# EAGLE schematic 1.5KbeaconDetectorV2.0 (EAGLE 9.6.2)
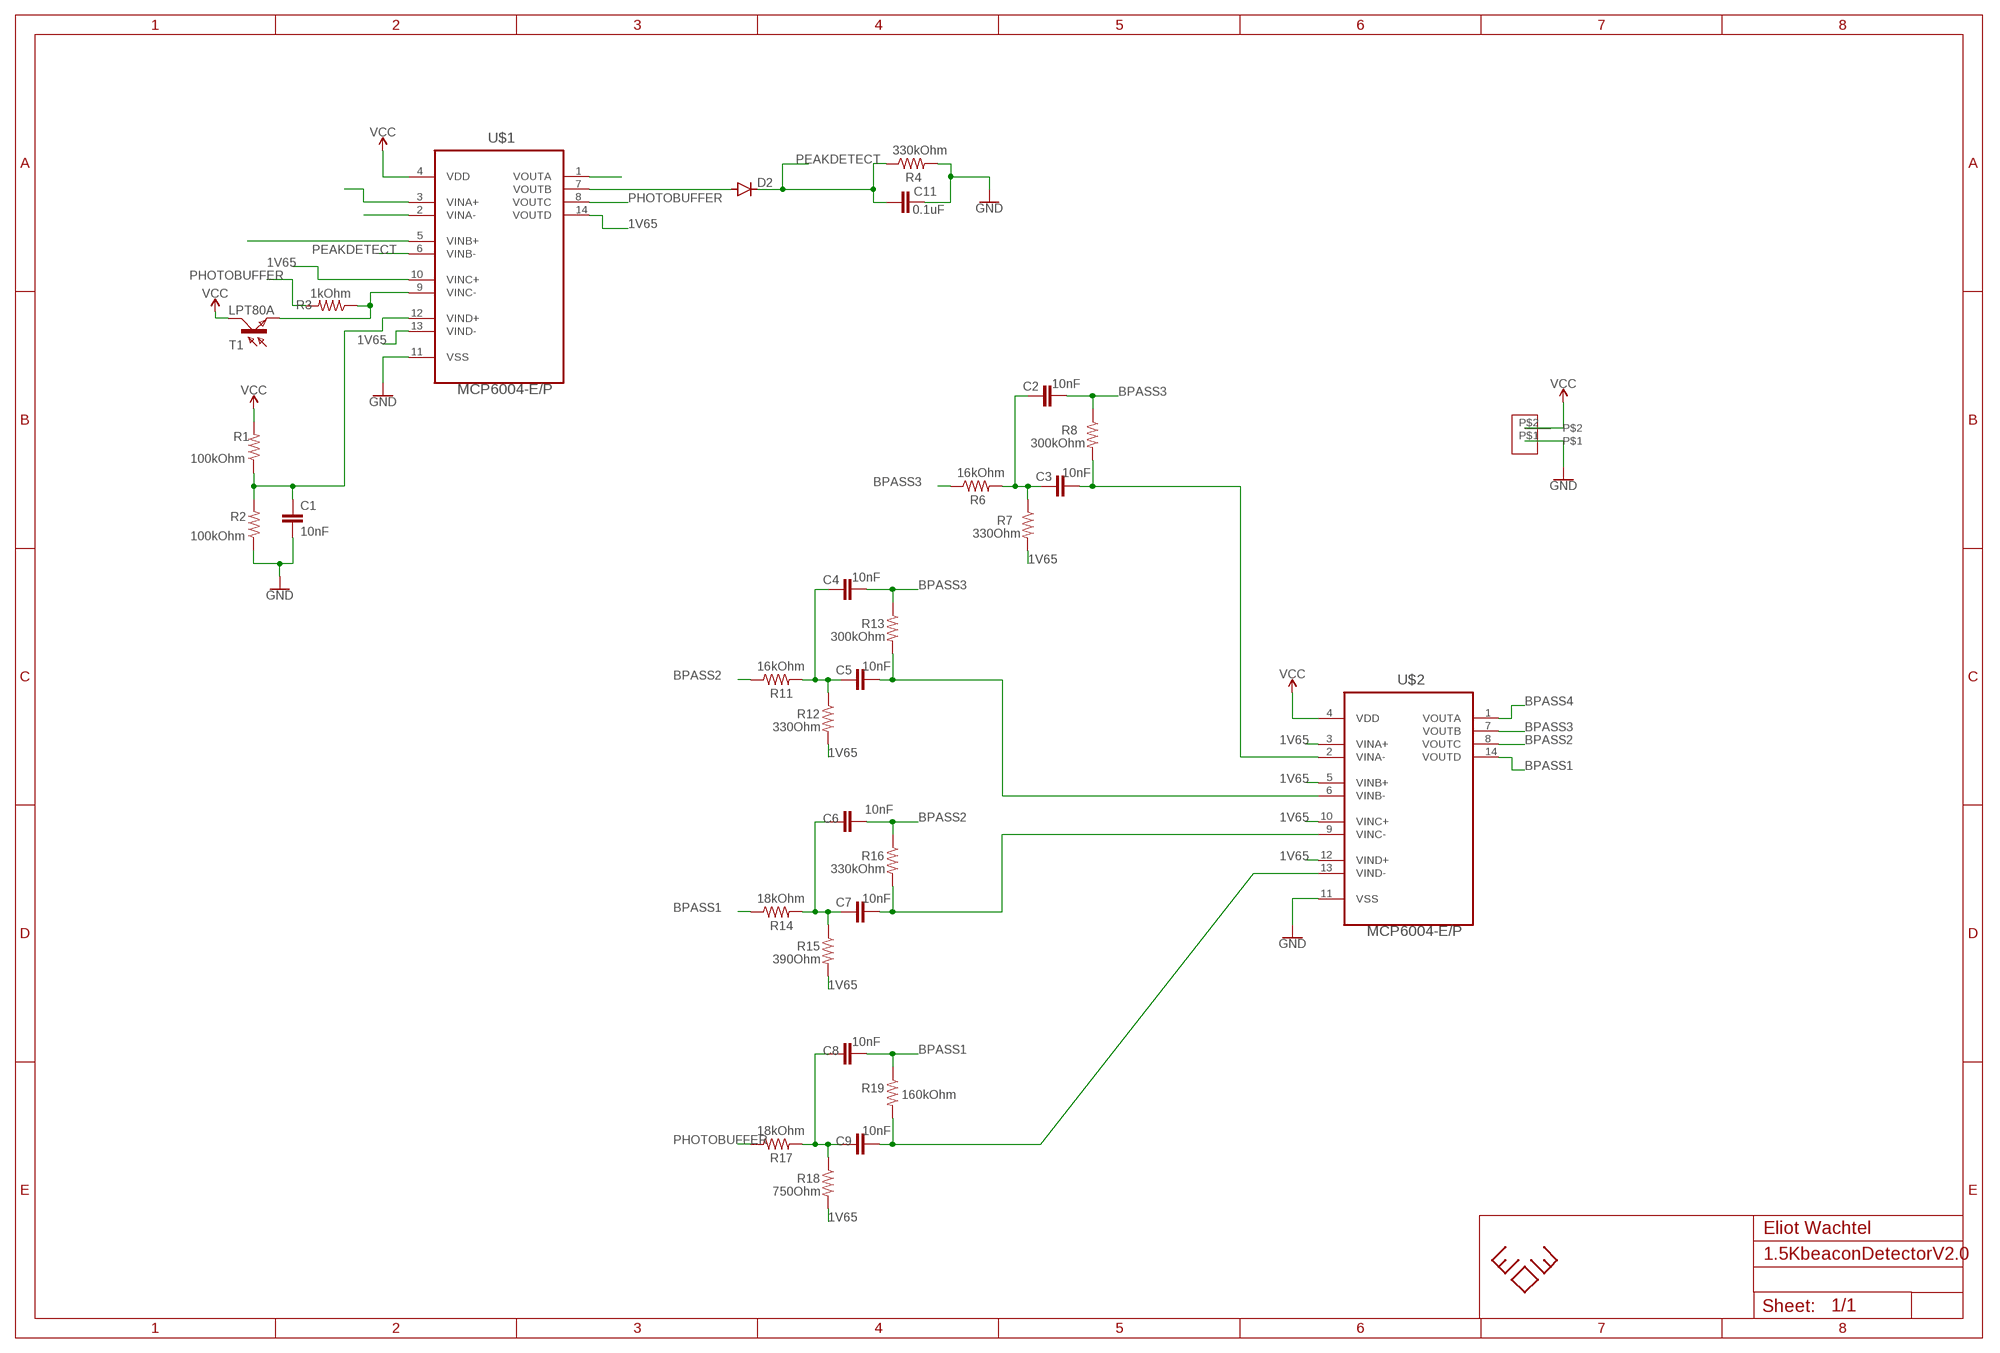
[diagram p0: schematic, sheet 1]

## Parts
C1  10nF  C5/2.5  [C5B2.5]
C2  10nF  C5/2.5  [C5B2.5]
C3  10nF  C5/2.5  [C5B2.5]
C4  10nF  C5/2.5  [C5B2.5]
C5  10nF  C5/2.5  [C5B2.5]
C6  10nF  C5/2.5  [C5B2.5]
C7  10nF  C5/2.5  [C5B2.5]
C8  10nF  C5/2.5  [C5B2.5]
C9  10nF  C5/2.5  [C5B2.5]
C11  0.1uF  C5/2.5  [C5B2.5]
D2  DIODE-D-7.5  [D-7.5]
R1  100kOhm  R-US_0204/7  [0204/7]
R2  100kOhm  R-US_0204/7  [0204/7]
R3  1kOhm  R-US_0204/2V  [0204V]
R4  330kOhm  R-US_0204/5  [0204/5]
R6  16kOhm  R-US_0204/2V  [0204V]
R7  330Ohm  R-US_0204/7  [0204/7]
R8  300kOhm  R-US_0204/5  [0204/5]
R11  16kOhm  R-US_0204/2V  [0204V]
R12  330Ohm  R-US_0204/7  [0204/7]
R13  300kOhm  R-US_0204/5  [0204/5]
R14  18kOhm  R-US_0204/5  [0204/5]
R15  390Ohm  R-US_0204/7  [0204/7]
R16  330kOhm  R-US_0204/5  [0204/5]
R17  18kOhm  R-US_0204/5  [0204/5]
R18  750Ohm  R-US_0204/7  [0204/7]
R19  160kOhm  R-US_0204/2V  [0204V]
T1  LPT80A  [LPT80A]
U$1  MCP6004-E/P  [DIP254P762X533-14]
U$2  MCP6004-E/P  [DIP254P762X533-14]
U$4  WIRECONNECT2PIN  [WIRECONNECT2PIN]

## Nets
1V65: R7.2 R12.2 R15.2 R18.2 U$1.10(VINC+) U$1.13(VIND-) U$1.14(VOUTD) U$2.3(VINA+) U$2.5(VINB+) U$2.10(VINC+) U$2.12(VIND+)
BPASS1: C8.2 R14.1 R19.1 U$2.14(VOUTD)
BPASS2: C6.2 R11.1 R16.1 U$2.8(VOUTC)
BPASS3: C2.2 C4.2 R6.1 R8.1 R13.1 U$2.7(VOUTB)
BPASS4: U$2.1(VOUTA)
GND: C1.2 C11.2 R2.1 R4.2 U$1.11(VSS) U$2.11(VSS) U$4.P$1
N$1: C1.1 R1.1 R2.2 U$1.12(VIND+)
N$2: D2.A U$1.7(VOUTB)
N$3: U$1.5(VINB+)
N$4: C2.1 C3.1 R6.2 R7.1
N$5: R3.1 T1.E U$1.9(VINC-)
N$6: U$1.1(VOUTA)
N$7: U$1.2(VINA-)
N$8: C4.1 C5.1 R11.2 R12.1
N$9: C7.2 R16.2 U$2.9(VINC-)
N$10: C6.1 C7.1 R14.2 R15.1
N$11: C9.2 R19.2 U$2.13(VIND-)
N$12: C8.1 C9.1 R17.2 R18.1
N$13: C5.2 R13.2 U$2.6(VINB-)
N$14: U$1.3(VINA+)
N$25: C3.2 R8.2 U$2.2(VINA-)
PEAKDETECT: C11.1 D2.C R4.1 U$1.6(VINB-)
PHOTOBUFFER: R3.2 R17.1 U$1.8(VOUTC)
VCC: R1.2 T1.C U$1.4(VDD) U$2.4(VDD) U$4.P$2

## Notes on the sheet
- Eliot Wachtel

## Library data of the parts
C1-C9 C11 = capacitor-wima:C: CAPACITOR naming: grid - package width
D2 = diode:DIODE-: DIODE
R1-R4 R6-R8 R11-R19 = adafruit:R-US_: RESISTOR, American symbol
T1 = opto-trans-siemens:LPT80A: PHOTO TRANSISTOR; OC_FARNELL: unknown; OC_NEWARK: unknown
U$1 U$2 = MCP6004-E_P:MCP6004-E/P: 1 MHz, Low-Power Op Amp; DESCRIPTION: Op Amp Quad Low Power Amplifier R-R I/O 6V Automotive 14-Pin PDIP Tube; DIGI-KEY_PART_NUMBER: MCP6004-E/P-ND; MF: Microchip Technology; MP: MCP6004-E/P; PACKAGE: DIP-14 Microchip; PURCHASE-URL: https://pricing.snapeda.com/search/part/MCP6004-E/P/?ref=eda
U$4 = connectors:WIRECONNECT2PIN